# Altium schematic sheet SCH_RTC.SchDoc
size A4
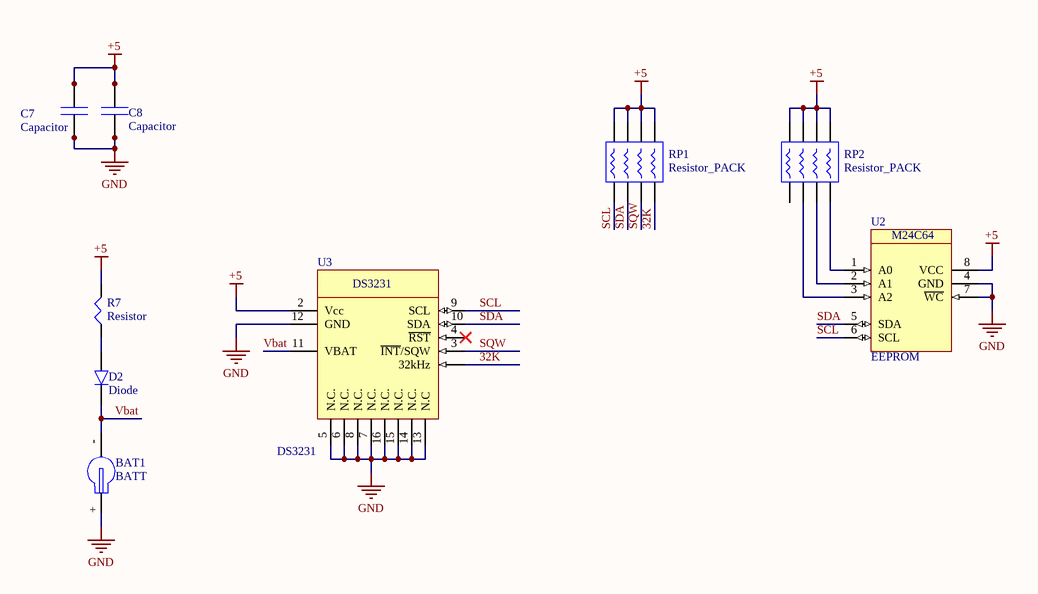
[diagram p0: SCH_RTC.SchDoc]

## Parts
BAT1  BATT
C7  Capacitor
C8  Capacitor
D2  Diode
R7  Resistor
RP1  Resistor_PACK
RP2  Resistor_PACK
U2  EEPROM
U3  DS3231

## Nets
+5: C7.39 C8.39 R7.48 RP1.1 RP1.3 RP1.5 RP1.7 RP2.1 RP2.3 RP2.5 RP2.7 U2.8(VCC) U3.2(Vcc)
GND: BAT1.+ C7.38 C8.38 U2.4(GND) U2.7(~{WC}) U3.5(N.C.) U3.6(N.C.) U3.7(N.C.) U3.8(N.C.) U3.12(GND) U3.13(N.C) U3.14(N.C.) U3.15(N.C.) U3.16(N.C.)
32K: RP1.8 U3.1(32kHz)
SCL: RP1.2 U2.6(SCL) U3.9(SCL)
SDA: RP1.4 U2.5(SDA) U3.10(SDA)
SQW: RP1.6 U3.3(~{INT}/SQW)
Vbat: BAT1.- D2.35 U3.11(VBAT)
NetD2_34: D2.34 R7.47
NetRP2_4: RP2.4 U2.3(A2)
NetRP2_6: RP2.6 U2.2(A1)
NetRP2_8: RP2.8 U2.1(A0)

Not connected (* = marked no-connect by the designer): RP2 2; U3 4(~{RST})*

## Notes on the sheet
- Title:
- Size:
- Author:
- A4
- Sheet
- of
- Revision:
- File:
- Date:
- (in symbol EEPROM) M24C64

## Library data of the parts
BAT1 = BATT: Porta Pila CR2032
C7 C8 = Capacitor: 100nF x 50v
D2 = Diode: Signal Diode
U3 = DS3231: Real Time Clock